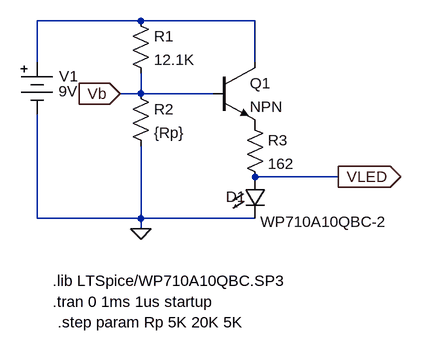
[diagram p0: schematic Photosensor.asc]
Photosensor.asc, the LTspice schematic file:
Version 4
SHEET 1 936 680
WIRE 16 32 -144 32
WIRE 192 32 16 32
WIRE -144 96 -144 32
WIRE 192 96 192 32
WIRE 16 144 16 112
WIRE 16 144 -16 144
WIRE 128 144 16 144
WIRE 320 272 192 272
WIRE -144 336 -144 176
WIRE 16 336 16 224
WIRE 16 336 -144 336
WIRE 192 336 16 336
WIRE 16 352 16 336
FLAG 16 352 0
FLAG -16 144 Vb
IOPIN -16 144 In
FLAG 320 272 VLED
IOPIN 320 272 Out
SYMBOL battery -144 80 R0
WINDOW 123 0 0 Left 2
WINDOW 0 34 37 Left 2
WINDOW 3 33 60 Left 2
SYMATTR InstName V1
SYMATTR Value 9V
SYMATTR SpiceLine Rser=0
SYMBOL res 0 16 R0
SYMATTR InstName R1
SYMATTR Value 12.1K
SYMBOL npn 128 96 R0
SYMATTR InstName Q1
SYMBOL res 0 128 R0
SYMATTR InstName R2
SYMATTR Value {Rp}
SYMBOL res 176 176 R0
SYMATTR InstName R3
SYMATTR Value 162
SYMBOL LED 176 272 R0
WINDOW 0 -29 31 Left 2
WINDOW 3 24 69 Left 2
SYMATTR InstName D1
SYMATTR Value WP710A10QBC-2
TEXT -120 432 Left 2 !.lib LTSpice/WP710A10QBC.SP3
TEXT -120 464 Left 2 !.tran 0 1ms 1us startup
TEXT -112 496 Left 2 !.step param Rp 5K 20K 5K

The netlist it stands for:
* Photosensor.asc
V1 N001 0 9V Rser=0
R1 N001 Vb 12.1K
Q1 N001 Vb P001 0 NPN
R2 Vb 0 {Rp}
R3 P001 VLED 162
D1 VLED 0 WP710A10QBC-2
.model D D
.lib standard.dio
.model NPN NPN
.model PNP PNP
.lib standard.bjt
.lib LTSpice/WP710A10QBC.SP3
.tran 0 1ms 1us startup
.step param Rp 5K 20K 5K
.backanno
.end

* Results of the author's LTspice run, read from the files saved beside the schematic
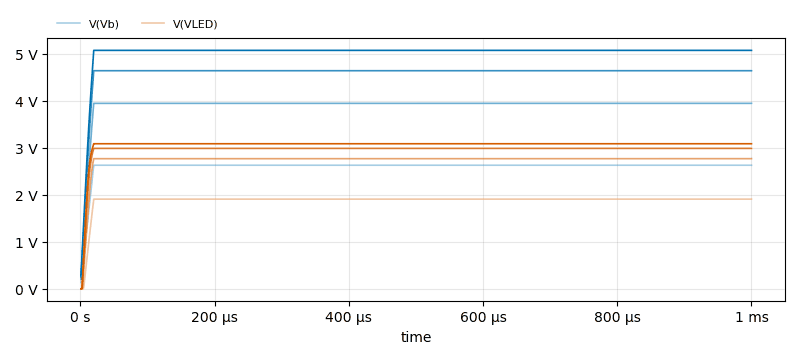
[diagram p1: Transient Analysis of Photosensor.asc, plotted from the saved traces]
* Transient Analysis, 7 runs:
*   V(Vb) [run 1]: min 131.6 mV, max 2.629 V, average 2.605 V, rms 2.613 V, last 2.629 V
*   V(Vb) [run 2]: 203.6 mV at time=1 µs, 203.6 mV at time=1 µs, min 203.6 mV, max 203.6 mV
*   V(Vb) [run 3]: min 203.6 mV, max 3.945 V, average 3.91 V, rms 3.921 V, last 3.945 V
*   V(Vb) [run 4]: 249.1 mV at time=1 µs, 249.1 mV at time=1 µs, min 249.1 mV, max 249.1 mV
*   V(Vb) [run 5]: min 249.1 mV, max 4.639 V, average 4.6 V, rms 4.612 V, last 4.639 V
*   V(Vb) [run 6]: 280.4 mV at time=1 µs, 280.4 mV at time=1 µs, min 280.4 mV, max 280.4 mV
*   V(Vb) [run 7]: min 280.4 mV, max 5.072 V, average 5.029 V, rms 5.043 V, last 5.072 V
*   V(VLED) [run 1]: min 0 V, max 1.907 V, average 1.886 V, rms 1.894 V, last 1.907 V
*   V(VLED) [run 2]: 3.694 nV at time=1 µs, 3.694 nV at time=1 µs, min 3.694 nV, max 3.694 nV
*   V(VLED) [run 3]: min 0 V, max 2.768 V, average 2.742 V, rms 2.751 V, last 2.768 V
*   V(VLED) [run 4]: 9.959 nV at time=1 µs, 9.959 nV at time=1 µs, min 9.959 nV, max 9.959 nV
*   V(VLED) [run 5]: min 0 V, max 2.987 V, average 2.962 V, rms 2.971 V, last 2.987 V
*   V(VLED) [run 6]: 26.31 nV at time=1 µs, 26.31 nV at time=1 µs, min 26.31 nV, max 26.31 nV
*   V(VLED) [run 7]: min 0 V, max 3.086 V, average 3.062 V, rms 3.07 V, last 3.086 V